# Altium project Ball_Machine_PCB_v2.PrjPCB
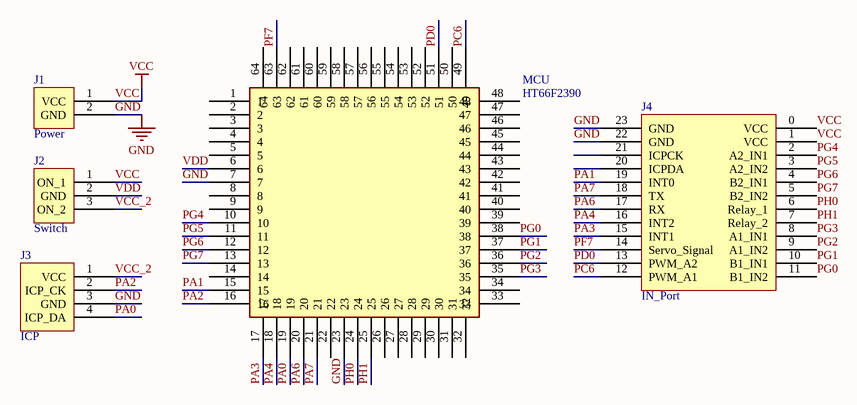
[diagram p0: Layout_v1.SchDoc]
1 sheet, 5 parts. Net scope: global (net labels, ports and power ports of the same name join across sheets).
Board files: Layout_v1.PcbDoc, Layout_v2.PcbDoc

## Sheet Layout_v1.SchDoc
size A4

### Parts
J1  Power  [Power_2P]
J2  Switch  [Switch_3P]
J3  ICP  [ICP_4P]
J4  IN_Port  [IC_Port_24P]
MCU  HT66F2390  [HT66F2390_64P]

### Nets
GND: J1.2(GND) J3.3(GND) J4.22(GND) J4.23(GND) MCU.7 MCU.23
VCC: J1.1(VCC) J2.1(ON_1) J4.0(VCC) J4.1(VCC)
PA0: J3.4(ICP_DA) MCU.19
PA1: J4.19(INT0) MCU.15
PA2: J3.2(ICP_CK) MCU.16
PA3: J4.15(INT1) MCU.17
PA4: J4.16(INT2) MCU.18
PA6: J4.17(RX) MCU.20
PA7: J4.18(TX) MCU.21
PC6: J4.12(PWM_A1) MCU.49
PD0: J4.13(PWM_A2) MCU.51
PF7: J4.14(Servo_Signal) MCU.63
PG0: J4.11(B1_IN2) MCU.38
PG1: J4.10(B1_IN1) MCU.37
PG2: J4.9(A1_IN2) MCU.36
PG3: J4.8(A1_IN1) MCU.35
PG4: J4.2(A2_IN1) MCU.10
PG5: J4.3(A2_IN2) MCU.11
PG6: J4.4(B2_IN1) MCU.12
PG7: J4.5(B2_IN2) MCU.13
PH0: J4.6(Relay_1) MCU.24
PH1: J4.7(Relay_2) MCU.25
VCC_2: J2.3(ON_2) J3.1(VCC)
VDD: J2.2(GND) MCU.6

Not connected (* = marked no-connect by the designer): J4 20(ICPDA) 21(ICPCK); MCU 1 2 3 4 5 8 9 14 22 26 27 28 29 30 31 32 33 34 39 40 41 42 43 44 45 46 47 48 50 52 53 54 55 56 57 58 59 60 61 62 64